# EAGLE design wisleep_dbg (EAGLE 6.5.0)
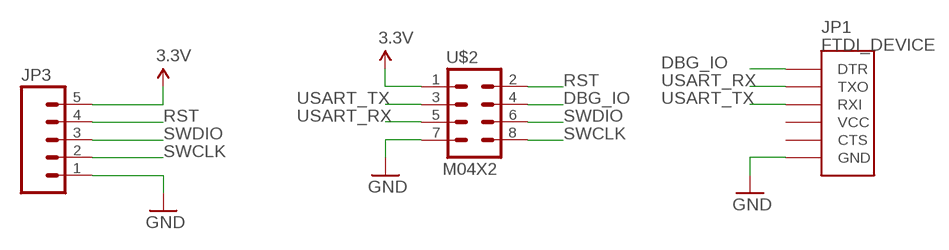
[diagram p0: schematic, sheet 1]

## Parts
JP1  FTDI_DEVICE  [FTDI_DEVICE_SIDE]
JP3  M05LOCK  [1X05_LOCK]
U$2  M04X2  [2X4]

## Nets
3.3V: JP3.5 U$2.1
DBG_IO: JP1.P$1(DTR) U$2.4
GND: JP1.P$6(GND) JP3.1 U$2.7
RST: JP3.4 U$2.2
SWCLK: JP3.2 U$2.8
SWDIO: JP3.3 U$2.6
USART_RX: JP1.P$2(TXO) U$2.5
USART_TX: JP1.P$3(RXI) U$2.3
Unconnected: JP1.P$4(VCC) JP1.P$5(CTS)

## Library data of the parts
JP1 = SparkFun-Connectors:FTDI_DEVICE: Connector which mates to FTDI basic or FTDI cable.
JP3 = SparkFun-Connectors:M05: Header 5 Standard 5-pin 0.1" header. Use with straight break away headers (SKU : PRT-00116), right angle break away headers (PRT-00553), swiss pins (PRT-00743), machine pins (PRT-00117), and female headers (PRT-00115). Molex polarized connector foot print use with SKU : PRT-08230 with associated crimp pins and housings.
U$2 = SparkFun-Connectors:M04X2: .1" header, two rows of four.

## Board
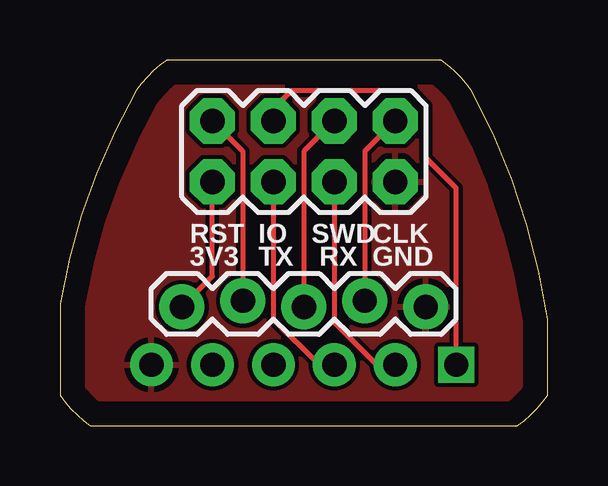
[diagram p1: board, top side]
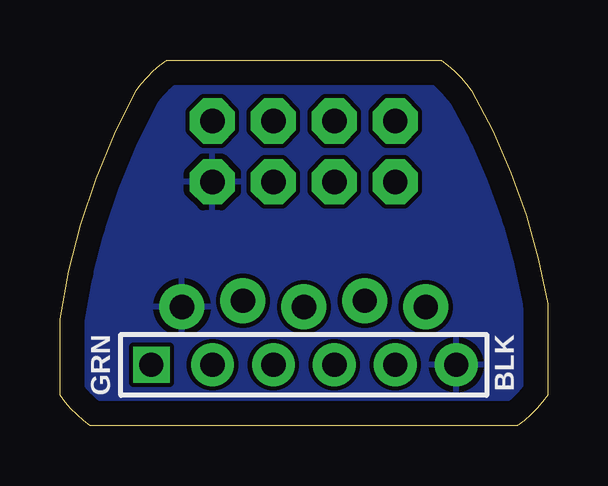
[diagram p2: board, bottom side, seen from below]

Size 20.32 x 15.24 mm. Coordinates in mm from the lower left corner, seen from the top.
Outline: 0,1.27 arc20 1.27,0 19.05,0 arc20 20.32,1.27 20.32,4.45 arc20 17.14,13.97 arc20 15.88,15.24 4.45,15.24 arc20 3.17,13.97 arc20 0,5.08 0,1.27
Copper layers (1*16): Top 0.035mm / dielectric 1.5mm / Bottom 0.035mm
Design rules "batchpcb_onthelimits": minimum track width 7mil, minimum drill 15mil, track to track 7mil, track to pad 7mil, pad to pad 7mil, via to via 7mil, smd to smd 7mil, copper to edge 40mil, drill to drill 7mil, minimum pad ring 10mil, minimum via ring 8mil, stop-mask expansion 4mil, vias tented up to drill 0mil, thermal gap 10mil

### Footprints (pad centres in the part's own frame; a part is rotated, then mirrored left to right if it is on the bottom)
FTDI_DEVICE_SIDE = drill 1 square: P$1 -6.35,0 | drill 1.016 pad 1.778: P$2 -3.81,0; P$3 -1.27,0; P$4 1.27,0; P$5 3.81,0; P$6 6.35,0
1X05_LOCK = drill 1.016 pad 1.88: 1 0,0.127; 2 2.54,-0.127; 3 5.08,0.127; 4 7.62,-0.127; 5 10.16,0.127
2X4 = drill 1.016 pad 1.88 octagon: 1 -3.81,-1.27; 2 -3.81,1.27; 3 -1.27,-1.27; 4 -1.27,1.27; 5 1.27,-1.27; 6 1.27,1.27; 7 3.81,-1.27; 8 3.81,1.27

### Placement (x,y rotation side)
JP1  10.16,2.54 0 bottom
JP3  15.24,5.08 180 top
U$2  10.16,11.43 0 top

### Tracks (layer width: path | path; a pad name or v marks a point on that pad's centre or on a via)
3.3V
  Top 0.2: U$2.1 6.35,6.22 JP3.5
DBG_IO
  Top 0.2: JP1.P$1 16.51,9.91 15.24,11.18 15.24,13.34 14.61,13.97 9.65,13.97 8.89,13.21 U$2.4
GND
  pour Top (isolate 0.025): 0,0 0,15.88 19.68,15.88 19.68,0
  pour Bottom (isolate 0.025): 0,0 0,15.88 19.68,15.88 19.68,0
RST
  Top 0.2: U$2.2 7.62,11.43 JP3.4
SWCLK
  Top 0.2: U$2.8 12.7,11.43 JP3.2
SWDIO
  Top 0.2: U$2.6 10.16,11.43 JP3.3
USART_RX
  Top 0.2: U$2.5 11.43,4.32 13.21,2.54 JP1.P$2
USART_TX
  Top 0.2: U$2.3 8.89,4.45 10.79,2.54 JP1.P$3

### Text on the board
_tsilk: RST | IO | SWD | CLK | 3V3 | TX | RX | GND
_bsilk: BLK | GRN